# Altium schematic sheet power.SchDoc
size A4
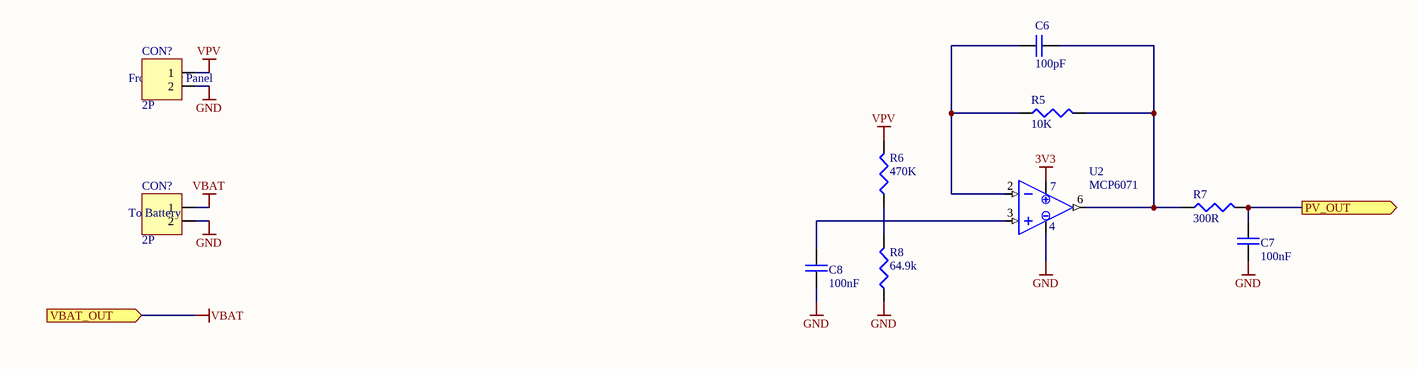
[diagram p0: power.SchDoc]

## Parts
(Parts that share a designator on the sheet are numbered #1, #2 ... from top to bottom, then left to right.)
C6  100pF  [0603]
C7  100nF  [0603]
C8  100nF  [0603]
CON?#1  2P  [JST-2MM]
CON?#2  2P  [INTERLOCK2-5MM-FIXED]
R5  10K  [0603]
R6  470K  [0603]
R7  300R  [0603]
R8  64.9k  [0603]
U2  MCP6071  [SOIC-8]

## Ports
PV_OUT (out), VBAT_OUT (in)

## Nets
3V3: U2.7(VDD)
GND: C7.1 C8.1 CON?#1.2 CON?#2.2 R8.1 U2.4(VSS)
VBAT: CON?#2.1 ; port VBAT_OUT
VPV: CON?#1.1 R6.2
PV_OUT: C7.2 R7.2 ; port PV_OUT
NetC6_1: C6.1 R5.1 U2.2(INN)
NetC6_2: C6.2 R5.2 R7.1 U2.6(VOUT)
NetC8_2: C8.2 U2.3(INP)
NetR6_1: R6.1 R8.2

## Notes on the sheet
- From Solar Panel
- To Battery

## Library data of the parts
C6-C8 = CAP: Capacitor; Owner: Nuno Brum; Sub-Type: Ceramic; Assembly: INS; Maximum Voltage: *; Creation Date: 2005-04-28; Status: Valid; Validation date: 2006-05-15; Type: Capacitor
CON?#1 CON?#2 = CON02: Connector 2 pins; Owner: Rui Rebelo; Assembly: INS; Sub-Type: Connector; Creation Date: 2005-05-27; Status: Valid; Validation Date: 2006-05-15; Type: Electrical & Mechanical
R5-R8 = RES: Resistor; Owner: Nuno Brum; Sub-Type: Generic; Assembly: INS; Validation date: 2006-05-15; Creation Date: 2002-07-17; Status: Valid; Power: *; Type: Resistor
U2 = MCP6V26: Low-Offset Opamp; Type: IC; Creation Date: 2012-03-15